# Altium schematic sheet Power.SchDoc: Power
size A4; Date: 9/24/2014; Author: P.A.; CompanyName: STMicroelectronics; Organization: Microcontrollers Division; Address1: 12, Rue Jules HOROWITZ; Address2: 38019 Grenoble; Address3: FRANCE; DocumentNumber: MB1189; Revision: B-07; SheetNumber: 10; SheetTotal: 13; Project: STM32F469I-DISCO
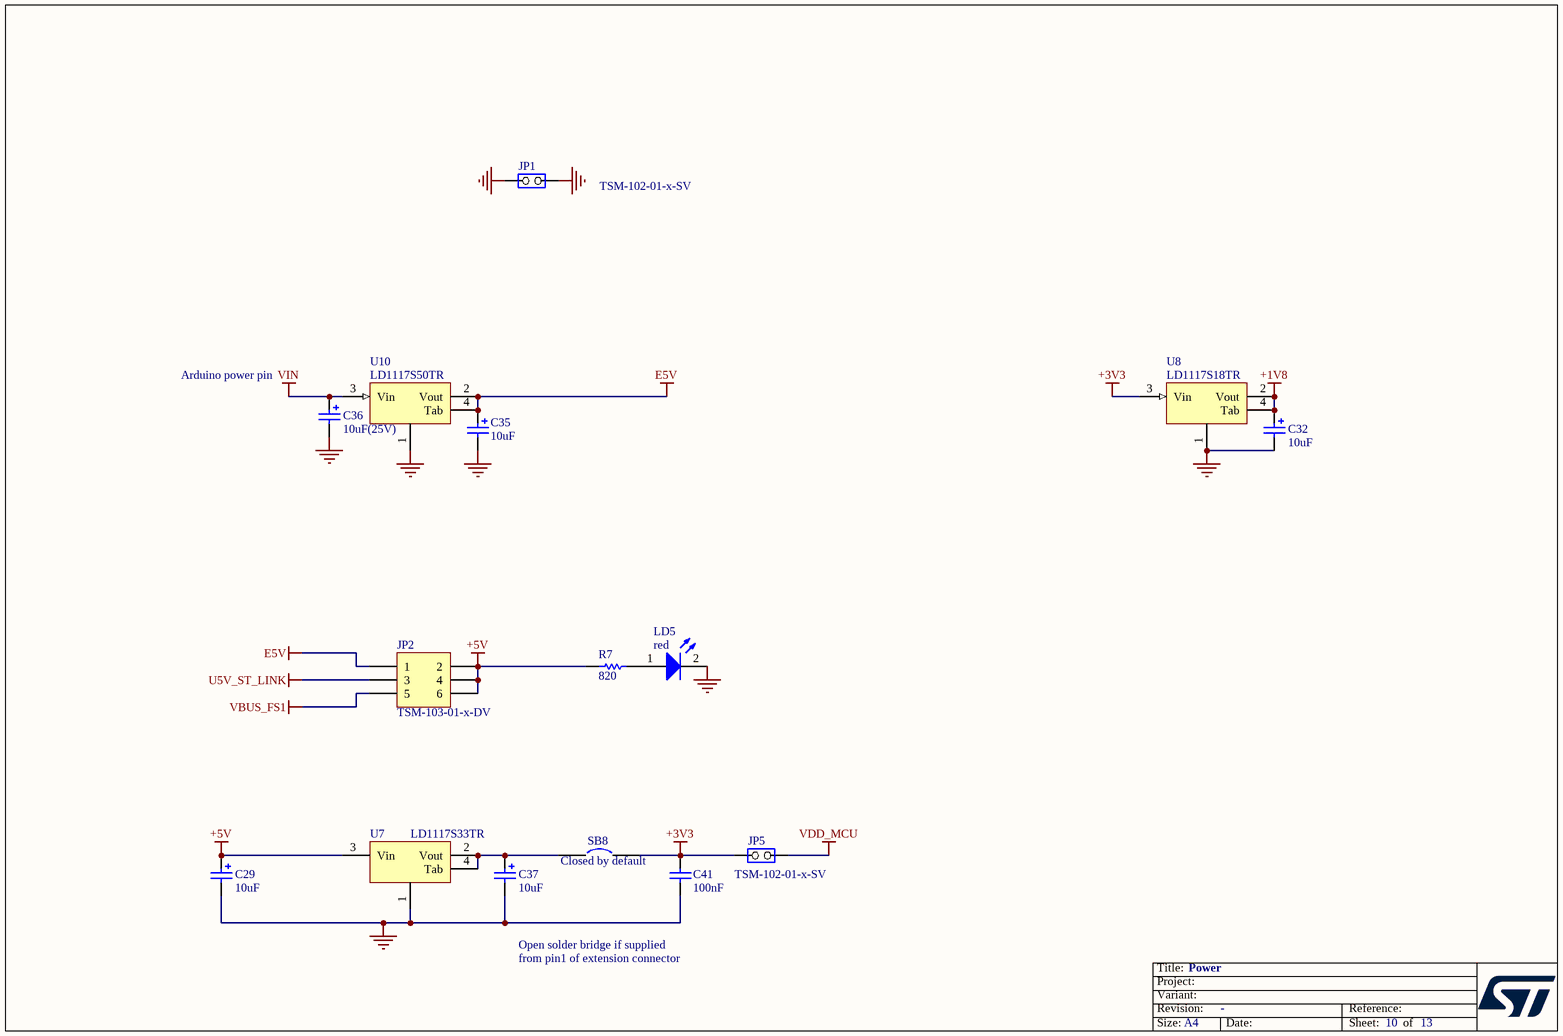
[diagram p0: Power.SchDoc]

## Parts
C29  10uF  [CPOL_TAJ-A_1206_H180]
C32  10uF  [CPOL_TAJ-A_1206_H180]
C35  10uF  [CPOL_TAJ-A_1206_H180]
C36  10uF(25V)  [CPOL_TAJ-B_1210_H210]
C37  10uF  [CPOL_TAJ-A_1206_H180]
C41  100nF  [0402C]
JP1  TSM-102-01-x-SV  [TSM-102-01-x-SV]
JP2  TSM-103-01-x-DV  [TSM-103-01-x-DV]
JP5  TSM-102-01-x-SV  [TSM-102-01-x-SV]
LD5  red  [0603D]
R7  820  [0603R]
SB8  Closed by default  [SB_0603]
U7  LD1117S33TR  [SOT-223]
U8  LD1117S18TR  [SOT-223]
U10  LD1117S50TR  [SOT-223]

## Nets
+1V8: C32.1 U8.2(Vout) U8.4(Tab)
+3V3: C41.1 JP5.1(COMMON) SB8.2 U8.3(Vin)
+5V: C29.1 JP2.2 JP2.4 JP2.6 R7.2 U7.3(Vin)
E5V: C35.1 JP2.1 U10.2(Vout) U10.4(Tab)
GND: C29.2 C32.2 C35.2 C36.2 C37.2 C41.2 JP1.1(COMMON) JP1.2(NO) LD5.2(K) U7.1 U8.1 U10.1
U5V_ST_LINK: JP2.3
VBUS_FS1: JP2.5
VDD_MCU: JP5.2(NO)
VIN: C36.1 U10.3(Vin)
NetC37_1: C37.1 SB8.1 U7.2(Vout) U7.4(Tab)
NetLD5_1: LD5.1(A) R7.1

## Notes on the sheet
- (near C36) Arduino power pin
- Open solder bridge if supplied
  from pin1 of extension connector
- Title:
- Project:
- Size:
- Revision:
- Variant:
- A4
- -
- Date:
- Reference:
- Sheet:
- of

## Library data of the parts
C29 = Cap_TAJA106K016R: Capacitor, Tantalum, 10uF, 16V, 10%, 3Ohms, pkg Type_A (3216 metric), T=1.6mm; Manuf_1: AVX; Value: 10uF (16v); Revision: July-2002: Re-released for DXP Platform.; Manuf_part_1: TAJA106K016R
C32 C35 C37 = Cap_TAJA106K016R: Capacitor, Tantalum, 10uF, 16V, 10%, 3Ohms, pkg Type_A (3216 metric), T=1.6mm; Manuf_1: AVX; Value: 10uF (16V); Revision: July-2002: Re-released for DXP Platform.; Manuf_part_1: TAJA106K016R
C36 = Cap_TAJB106K025RNJ: Capacitor, Tantalum, 10uF, 25V, 10%, 2.5ohms, pkg Type_B (3528 metric), T=1.9mm; Manuf_1: AVX; Revision: July-2002: Re-released for DXP Platform.; Value: 10uF (25V); Manuf_part_1: TAJB106K025RNJ
C41 = Cap: Capacitor; Manuf_part_1: CC0402KRX7R7BB104; Manuf_1: YAGEO; Ordered by: Subcon; Published: 8-Jun-2000; Revision: July-2002: Re-released for DXP Platform.; Publisher: Altium Limited; Value: 100nF
JP1 = JP2: Manuf_1: SAMTEC; Ordered by: Subcon; Silkscreen: GND; Assembly: with jumper; Manuf_Part_1: TSM-102-01-x-SV
JP2 = Header 3X2: Header, 3-Pin, Dual row; Manuf_1: SAMTEC; Ordered by: Subcon; Silkscreen: E5V:pins1,2 STLK: pins3,4 USB: pins 5,6; Assembly: 3,4 closed; LatestRevisionDate: 17-Jul-2002; LatestRevisionNote: Re-released for DXP Platform.; Publisher: Altium Limited; Manuf_Part_1: TSM-103-01-x-DV
JP5 = JP2: Manuf_1: SAMTEC; Ordered by: Subcon; Assembly: with jumper; Silkscreen: IDD; Manuf_Part_1: TSM-102-01-x-SV
LD5 = LED2: Typical RED, GREEN, YELLOW, AMBER GaAs LED; Manuf_1: Everlight Electronics; Manuf_part_1: 19-217/R6C-AL1M2VY/3T; Ordered by: Subcon; ECCN_US/EU: EAR99/NEC; Silkscreen: 5V; Published: 8-Jun-2000; Revision: July-2002: Re-released for DXP Platform.; Publisher: Altium Limited
R7 = res1: Resistor; Manuf_1: YAGEO; Manuf_part_1: RC0603FR-07820RL; Ordered by: Subcon; Published: 8-Jun-2000; Revision: July-2002: Re-released for DXP Platform.; Publisher: Altium Limited; Value: 820
SB8 = Circuit Breaker: Ordered by: Subcon; Comments: Solder bridge; Published: 24-Mar-1999; Revision: July-2002: Re-released for DXP Platform.; Publisher: Altium Limited; ECCN_US/EU: n/a
U7 = LD1117S33TR: LOW DROP FIXED AND ADJUSTABLE POSITIVE VOLTAGE REGULATORS (3.3 Volts); Provided: ST; ECCN_US/EU: EAR99/NEC; Ref St: 9176186; Manuf_1: ST; Manuf_Part_1: LD1117S33TR; Order: LD1117S33TR; Distrib: ST; Ordered by: ST
U8 = LD1117: Ordered by: ST; ECCN_US/EU: EAR99/NEC; Ref St: 9176180; Manuf_1: ST; Manuf_Part_1: LD1117S18TR
U10 = LD1117: Ordered by: ST; ECCN_US/EU: EAR99/NEC; Ref St: 9176133; Manuf_1: ST; Manuf_Part_1: LD1117S50TR